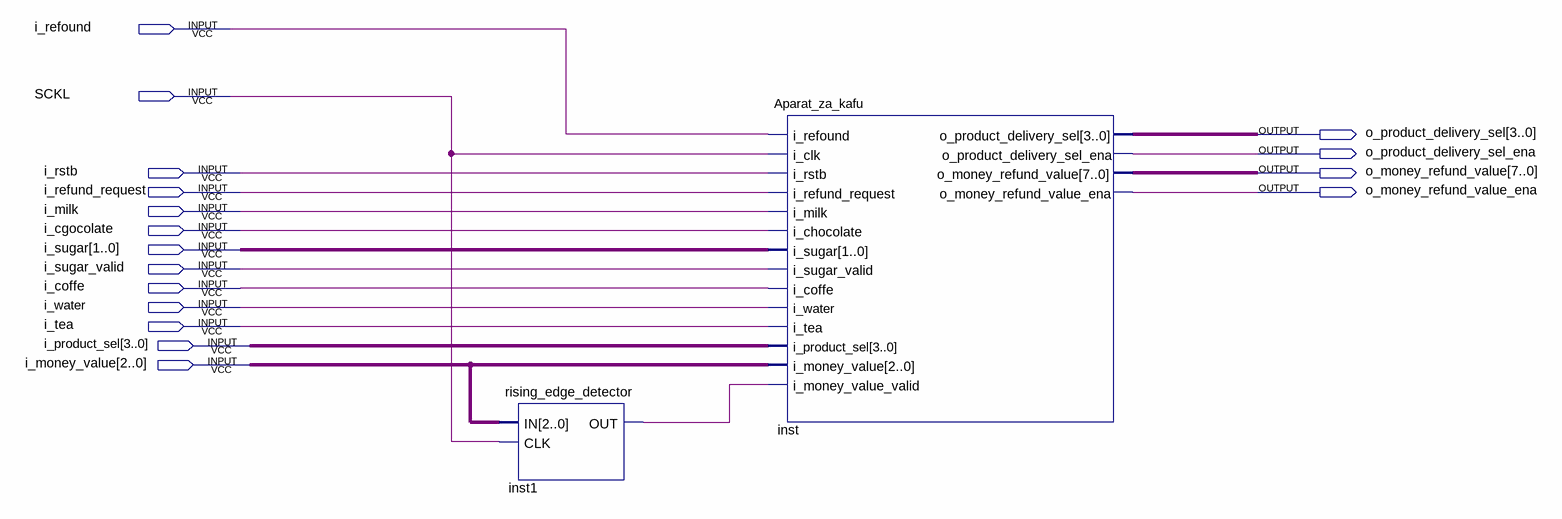
[diagram p0: schematic sheet]
// Quartus schematic test_sema.bdf as structural Verilog: 2 symbols, 17 pins
module test_sema (
  input  i_refound,
  input  SCKL,
  input  i_rstb,
  input  i_refund_request,
  input  i_milk,
  input  i_cgocolate,
  input  [1:0] i_sugar,
  input  i_sugar_valid,
  input  i_coffe,
  input  i_water,
  input  i_tea,
  input  [3:0] i_product_sel,
  input  [2:0] i_money_value,
  output [3:0] o_product_delivery_sel,
  output o_product_delivery_sel_ena,
  output [7:0] o_money_refund_value,
  output o_money_refund_value_ena
);

  wire inst1_out;

  rising_edge_detector inst1 (.IN(i_money_value), .CLK(SCKL), .OUT(inst1_out));
  Aparat_za_kafu inst (
    .i_refound(i_refound), .i_clk(SCKL), .i_rstb(i_rstb), .i_refund_request(i_refund_request),
    .i_milk(i_milk), .i_chocolate(i_cgocolate), .i_sugar(i_sugar), .i_sugar_valid(i_sugar_valid),
    .i_coffe(i_coffe), .i_water(i_water), .i_tea(i_tea), .i_product_sel(i_product_sel),
    .i_money_value(i_money_value), .i_money_value_valid(inst1_out),
    .o_product_delivery_sel(o_product_delivery_sel), .o_product_delivery_sel_ena(o_product_delivery_sel_ena),
    .o_money_refund_value(o_money_refund_value), .o_money_refund_value_ena(o_money_refund_value_ena));
endmodule
